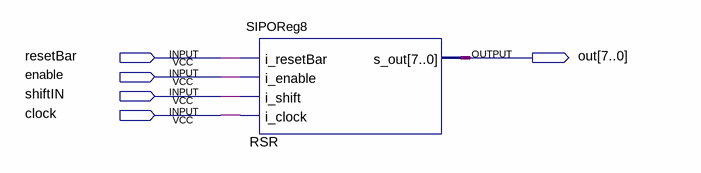
[diagram p0: schematic sheet]
// Quartus schematic testSIPO.bdf as structural Verilog: 1 symbols, 5 pins
module testSIPO (
  input  resetBar,
  input  enable,
  input  shiftIN,
  input  clock,
  output [7:0] out
);

  SIPOReg8 RSR (.i_resetBar(resetBar), .i_enable(enable), .i_shift(shiftIN), .i_clock(clock), .s_out(out));
endmodule
